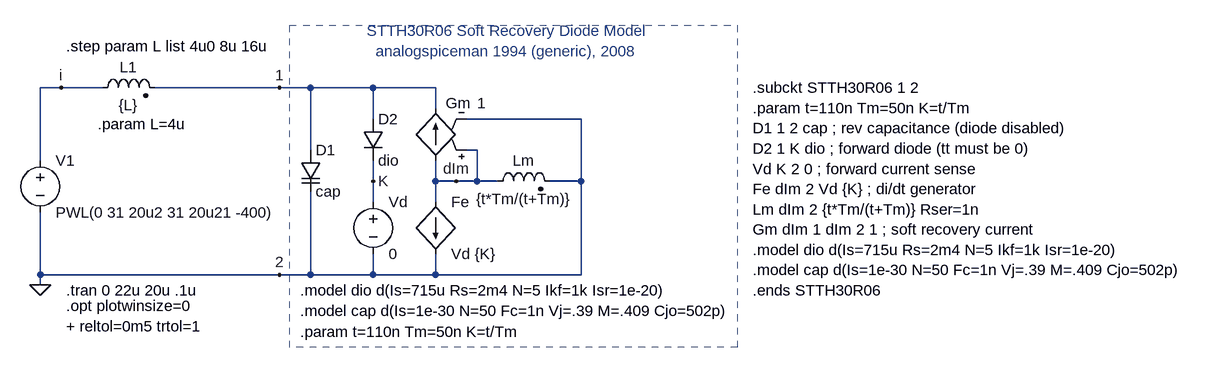
[diagram p0: schematic STTH30R06.asc]
STTH30R06.asc, the LTspice schematic file:
Version 4
SHEET 1 1724 904
WIRE -112 112 -144 112
WIRE -48 112 -112 112
WIRE 224 112 32 112
WIRE 272 112 224 112
WIRE 368 112 272 112
WIRE 464 112 368 112
WIRE 464 144 464 112
WIRE 368 160 368 112
WIRE 688 160 512 160
WIRE 272 208 272 112
WIRE 528 208 512 208
WIRE -144 224 -144 112
WIRE 368 256 368 224
WIRE 464 256 464 224
WIRE 496 256 464 256
WIRE 528 256 528 208
WIRE 528 256 496 256
WIRE 560 256 528 256
WIRE 688 256 688 160
WIRE 688 256 640 256
WIRE 368 288 368 256
WIRE 464 288 464 256
WIRE -144 400 -144 304
WIRE 224 400 -144 400
WIRE 272 400 272 272
WIRE 272 400 224 400
WIRE 368 400 368 368
WIRE 368 400 272 400
WIRE 464 400 464 368
WIRE 464 400 368 400
WIRE 688 400 688 256
WIRE 688 400 464 400
WIRE -144 416 -144 400
FLAG -144 416 0
FLAG 496 256 dIm
FLAG 368 256 K
FLAG 224 112 1
FLAG 224 400 2
FLAG -112 112 i
SYMBOL voltage -144 208 R0
WINDOW 123 0 0 Left 0
WINDOW 39 0 0 Left 0
SYMATTR InstName V1
SYMATTR Value PWL(0 31 20u2 31 20u21 -400)
SYMBOL ind2 -64 128 R270
WINDOW 0 32 56 VTop 0
WINDOW 3 5 56 VBottom 0
SYMATTR InstName L1
SYMATTR Value {L}
SYMATTR Type ind
SYMATTR SpiceLine Rser=1 Rpar=500 Cpar=10p
SYMBOL varactor 256 208 R0
SYMATTR InstName D1
SYMATTR Value cap
SYMBOL diode 352 160 R0
SYMATTR InstName D2
SYMATTR Value dio
SYMBOL voltage 368 272 R0
SYMATTR InstName Vd
SYMATTR Value 0
SYMBOL f 464 288 R0
SYMATTR InstName Fe
SYMATTR Value Vd {K}
SYMBOL ind2 544 272 R270
WINDOW 0 32 56 VTop 0
WINDOW 3 4 56 VBottom 0
SYMATTR InstName Lm
SYMATTR Value {t*Tm/(t+Tm)}
SYMATTR Type ind
SYMATTR SpiceLine Rser=1n
SYMBOL g2 464 128 M0
WINDOW 0 -16 8 Right 0
WINDOW 3 -64 8 Right 0
SYMATTR InstName Gm
SYMATTR Value 1
TEXT 576 40 Center 0 ;STTH30R06 Soft Recovery Diode Model\nanalogspiceman 1994 (generic), 2008
TEXT 256 424 Left 0 !.model dio d(Is=715u Rs=2m4 N=5 Ikf=1k Isr=1e-20)
TEXT 256 488 Left 0 !.param t=110n Tm=50n K=t/Tm
TEXT -104 424 Left 0 !.tran 0 22u 20u .1u
TEXT 256 456 Left 0 !.model cap d(Is=1e-30 N=50 Fc=1n Vj=.39 M=.409 Cjo=502p)
TEXT -104 48 Left 0 !.step param L list 4u0 8u 16u
TEXT -56 168 Left 0 !.param L=4u
TEXT 952 112 Left 0 !.subckt STTH30R06 1 2\n.param t=110n Tm=50n K=t/Tm\nD1 1 2 cap ; rev capacitance (diode disabled)\nD2 1 K dio ; forward diode (tt must be 0)\nVd K 2 0 ; forward current sense\nFe dIm 2 Vd {K} ; di/dt generator\nLm dIm 2 {t*Tm/(t+Tm)} Rser=1n\nGm dIm 1 dIm 2 1 ; soft recovery current \n.model dio d(Is=715u Rs=2m4 N=5 Ikf=1k Isr=1e-20)\n.model cap d(Is=1e-30 N=50 Fc=1n Vj=.39 M=.409 Cjo=502p)\n.ends STTH30R06
TEXT -104 448 Left 0 !.opt plotwinsize=0\n+ reltol=0m5 trtol=1
RECTANGLE Normal 928 512 240 16 2

The netlist it stands for:
* STTH30R06.asc
V1 i 0 PWL(0 31 20u2 31 20u21 -400)
L1 i 1 {L} Rser=1 Rpar=500 Cpar=10p
D1 1 0 cap
D2 1 K dio
Vd K 0 0
Fe dIm 0 Vd {K}
Lm dIm 0 {t*Tm/(t+Tm)} Rser=1n
Gm dIm 1 dIm 0 1
.model D D
.lib standard.dio
* STTH30R06 Soft Recovery Diode Model
* analogspiceman 1994 (generic), 2008
.model dio d(Is=715u Rs=2m4 N=5 Ikf=1k Isr=1e-20)
.param t=110n Tm=50n K=t/Tm
.tran 0 22u 20u .1u
.model cap d(Is=1e-30 N=50 Fc=1n Vj=.39 M=.409 Cjo=502p)
.step param L list 4u0 8u 16u
.param L=4u
.subckt STTH30R06 1 2
.param t=110n Tm=50n K=t/Tm
D1 1 2 cap ; rev capacitance (diode disabled)
D2 1 K dio ; forward diode (tt must be 0)
Vd K 2 0 ; forward current sense
Fe dIm 2 Vd {K} ; di/dt generator
Lm dIm 2 {t*Tm/(t+Tm)} Rser=1n
Gm dIm 1 dIm 2 1 ; soft recovery current
.model dio d(Is=715u Rs=2m4 N=5 Ikf=1k Isr=1e-20)
.model cap d(Is=1e-30 N=50 Fc=1n Vj=.39 M=.409 Cjo=502p)
.ends STTH30R06
.opt plotwinsize=0
+ reltol=0m5 trtol=1
.backanno
.end